# EAGLE design LPC_4TE_3.42taster Jalo (EAGLE 5.03)
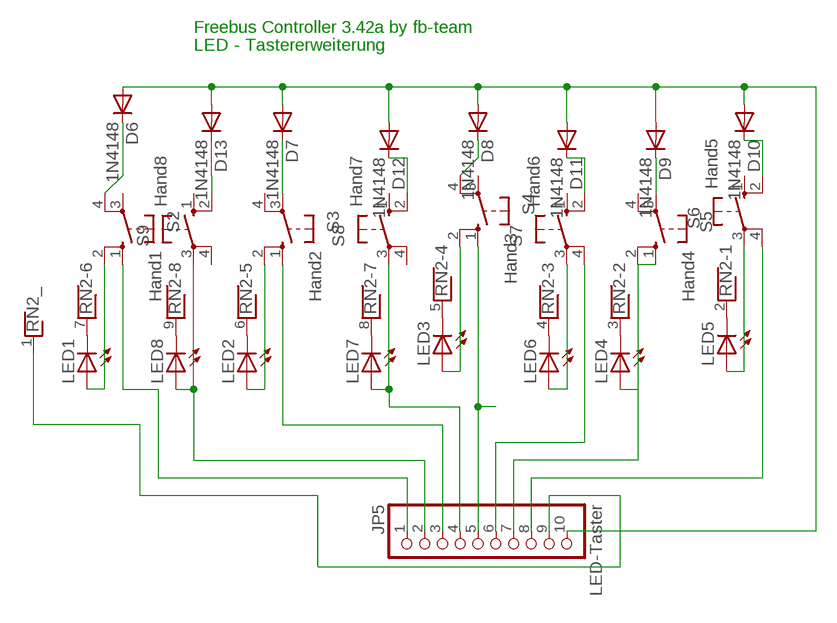
[diagram p0: schematic, sheet 1]

## Parts
D6  1N4148  [DO35-10]
D7  1N4148  [DO35-10]
D8  1N4148  [DO35-10]
D9  1N4148  [DO35-10]
D10  1N4148  [DO35-10]
D11  1N4148  [DO35-10]
D12  1N4148  [DO35-10]
D13  1N4148  [DO35-10]
JP5  LED-Taster  PINHD-1X10  [1X10]
LED1  LED3MM  [LED3MM]
LED2  LED3MM  [LED3MM]
LED3  LED3MM  [LED3MM]
LED4  LED3MM  [LED3MM]
LED5  LED3MM  [LED3MM]
LED6  LED3MM  [LED3MM]
LED7  LED3MM  [LED3MM]
LED8  LED3MM  [LED3MM]
RN2  RNX8  [RN-9]
S2  Hand1  10-XX  [B3F-10XX]
S3  Hand2  10-XX  [B3F-10XX]
S4  Hand3  10-XX  [B3F-10XX]
S5  Hand4  10-XX  [B3F-10XX]
S6  Hand5  10-XX  [B3F-10XX]
S7  Hand6  10-XX  [B3F-10XX]
S8  Hand7  10-XX  [B3F-10XX]
S9  Hand8  10-XX  [B3F-10XX]

## Nets
N$1: D6.C S2.4(P1)
N$2: LED5.A S6.3(P)
N$3: JP5.7 S5.1(S)
N$4: D10.C S6.2(S1)
N$5: D13.C S9.2(S1)
N$6: D8.C S4.4(P1)
N$7: D9.C S5.3(P)
N$8: LED1.A S2.2(S1)
N$9: D11.C S7.2(S1)
N$10: D12.C S8.2(S1)
N$11: D7.C S3.3(P)
N$12: JP5.5 S4.1(S)
N$13: LED7.K(C) RN2.8
N$14: LED1.K(C) RN2.7
N$15: LED6.K(C) RN2.4
N$16: LED5.K(C) RN2.2
N$17: LED4.K(C) RN2.3
N$18: LED3.K(C) RN2.5
N$19: LED2.K(C) RN2.6
N$20: LED8.K(C) RN2.9
N$21: JP5.6 S7.4(P1)
N$22: LED3.A S4.2(S1)
N$23: LED2.A S3.2(S1)
N$24: JP5.8 S6.4(P1)
N$25: JP5.9 RN2.1
N$26: LED6.A S7.3(P)
N$29: JP5.4 LED7.A S8.3(P)
N$30: JP5.2 LED8.A S9.3(P)
N$31: LED4.A S5.2(S1)
N$33: JP5.3 S3.1(S)
N$36: D6.A D7.A D8.A D9.A D10.A D11.A D12.A D13.A JP5.10
N$45: JP5.1 S2.1(S)
Unconnected: S2.3(P) S3.4(P1) S4.3(P) S5.4(P1) S6.1(S) S7.1(S) S8.1(S) S8.4(P1) S9.1(S) S9.4(P1)

## Notes on the sheet
- Freebus Controller 3.42a by fb-team
- LED - Tastererweiterung

## Library data of the parts
D6-D13 = diode:1N4148: DIODE high speed (Philips)
JP5 = pinhead:PINHD-1X10: PIN HEADER
LED1-LED8 = led:LED: LED OSRAM: - CHIPLED LG R971, LG N971, LY N971, LG Q971, LY Q971, LO R971, LY R971 LH N974, LH R974 LS Q976, LO Q976, LY Q976 LO Q996 - Hyper CHIPLED LW Q18S LB Q993, LB Q99A, LB R99A - SideLED LS A670, LO A670, LY A670, LG A670, LP A670 LB A673, LV A673, LT A673, LW A673 LH A674 LY A675 LS A676, LA A676, LO A676, LY A676, LW A676 LS A679, LY A679, LG A679 - Hyper Micro SIDELED® LS Y876, LA Y876, LO Y876, LY Y876 LT Y87S - SmartLED LW L88C, LW L88S LB L89C, LB L89S, LG L890 LS L89K, LO L89K, LY L89K LS L896, LA L896, LO L896, LY L896 - TOPLED LS T670, LO T670, LY T670, LG T670, LP T670 LSG T670, LSP T670, LSY T670, LOP T670, LYG T670 LG T671, LOG T671, LSG T671 LB T673, LV T673, LT T673, LW T673 LH T674 LS T676, LA T676, LO T676, LY T676, LB T676, LH T676, LSB T676, LW T676 LB T67C, LV T67C, LT T67C, LS T67K, LO T67K, LY T67K, LW E67C LS E67B, LA E67B, LO E67B, LY E67B, LB E67C, LV E67C, LT E67C LW T67C LS T679, LY T679, LG T679 LS T770, LO T770, LY T770, LG T770, LP T770 LB T773, LV T773, LT T773, LW T773 LH T774 LS E675, LA E675, LY E675, LS T675 LS T776, LA T776, LO T776, LY T776, LB T776 LHGB T686 LT T68C, LB T68C - Hyper Mini TOPLED® LB M676 - Mini TOPLED Santana® LG M470 LS M47K, LO M47K, LY M47K Source: http://www.osram.convergy.de - LUMILED® LXK2-PW12-R00, LXK2-PW12-S00, LXK2-PW14-U00, LXK2-PW14-V00 LXK2-PM12-R00, LXK2-PM12-S00, LXK2-PM14-U00 LXK2-PE12-Q00, LXK2-PE12-R00, LXK2-PE12-S00, LXK2-PE14-T00, LXK2-PE14-U00 LXK2-PB12-K00, LXK2-PB12-L00, LXK2-PB12-M00, LXK2-PB14-N00, LXK2-PB14-P00, LXK2-PB14-Q00 LXK2-PR12-L00, LXK2-PR12-M00, LXK2-PR14-Q00, LXK2-PR14-R00 LXK2-PD12-Q00, LXK2-PD12-R00, LXK2-PD12-S00 LXK2-PH12-R00, LXK2-PH12-S00 LXK2-PL12-P00, LXK2-PL12-Q00, LXK2-PL12-R00 Source: www.luxeon.com
RN2 = resistor-net:RNX8: RESISTOR NETWORK
S2-S9 = switch-omron:10-XX: OMRON SWITCH

## Board
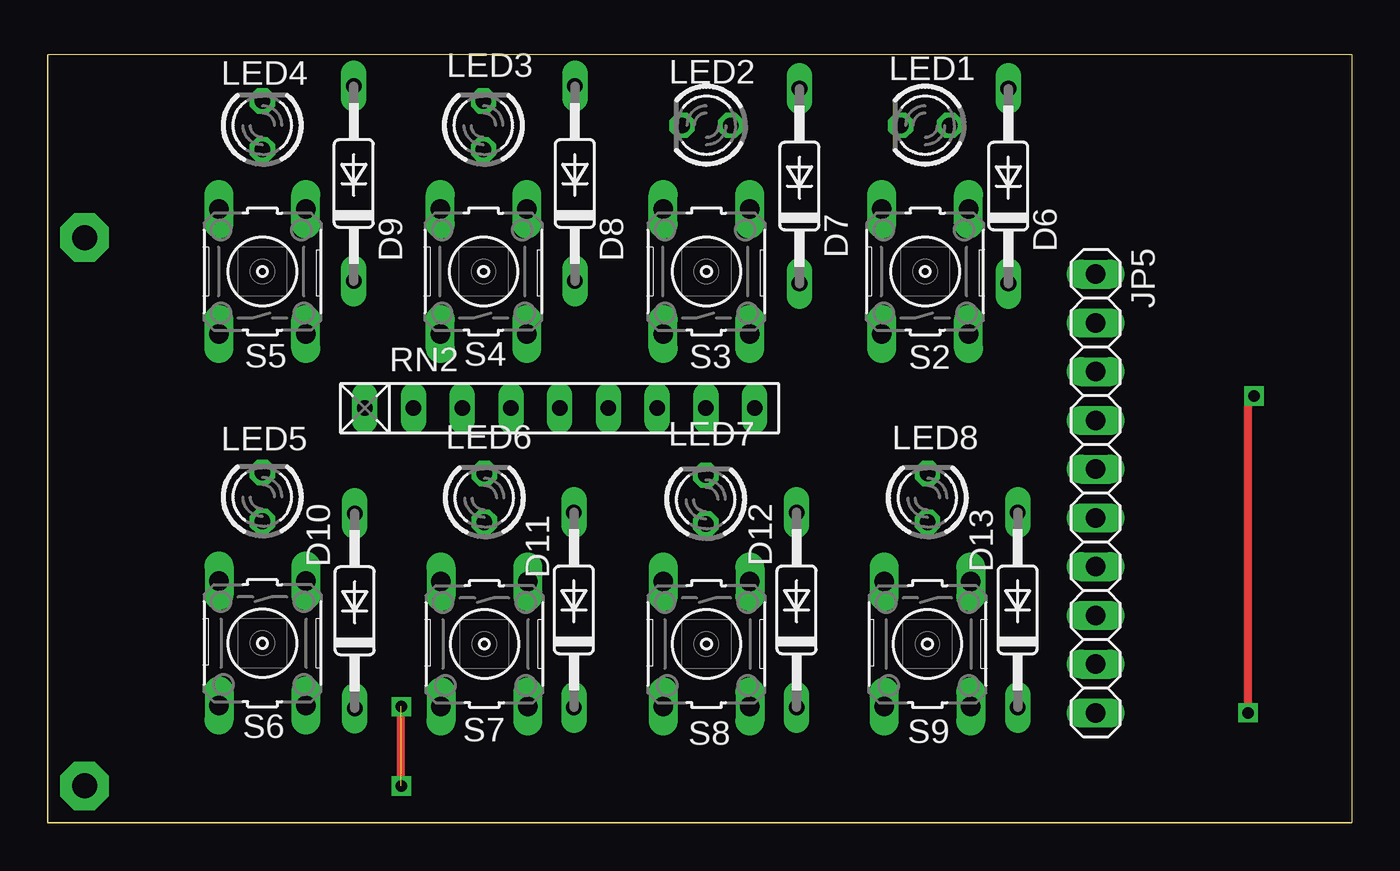
[diagram p1: board, top side]
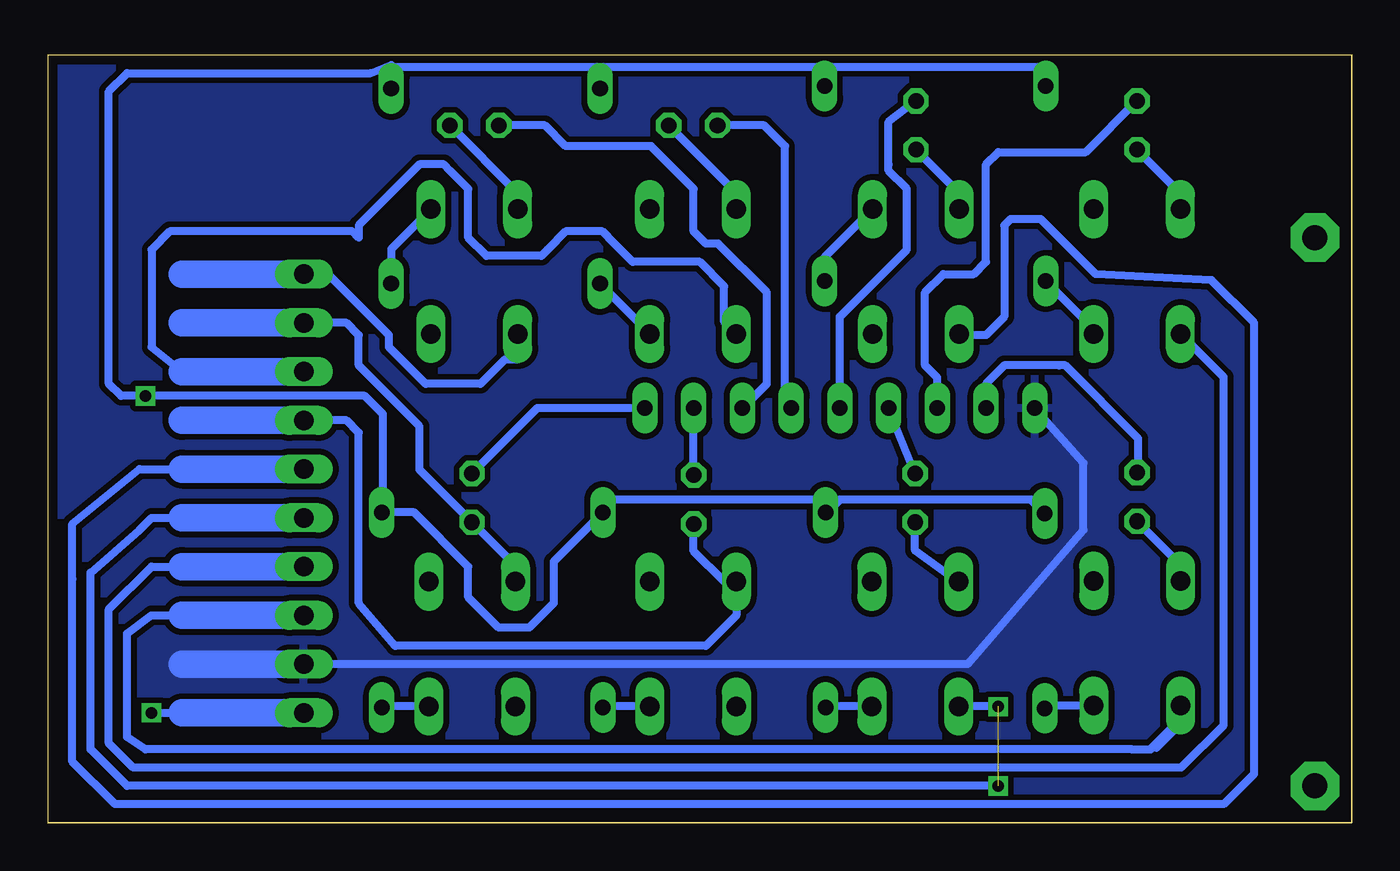
[diagram p2: board, bottom side, seen from below]

Size 67.94 x 40.01 mm. Coordinates in mm from the lower left corner, seen from the top.
Outline: 0,0 0,40.01
Outline: 67.94,0 67.94,40.01 0,40.01
Outline: 67.94,0 0,0
Outline: 0,40.01 0,0
Outline: 0,0 67.94,0
Copper layers (1*16): Top 0.035mm / dielectric 1.5mm / Bottom 0.035mm
Design rules "default *": minimum track width 10mil, minimum drill 24mil, track to track 12mil, track to pad 12mil, pad to pad 12mil, via to via 12mil, smd to smd 8mil, copper to edge 20mil, drill to drill 8mil, minimum pad ring 10mil, minimum via ring 8mil, stop-mask expansion 4mil, vias tented up to drill 0mil, thermal gap 10mil

### Footprints (pad centres in the part's own frame; a part is rotated, then mirrored left to right if it is on the bottom)
DO35-10 = drill 0.813 long: A 5.08,0; C -5.08,0
1X10 = drill 1.016 long: 1 -11.43,0; 2 -8.89,0; 3 -6.35,0; 4 -3.81,0; 5 -1.27,0; 6 1.27,0; 7 3.81,0; 8 6.35,0; 9 8.89,0; 10 11.43,0
LED3MM = drill 0.813 octagon: A -1.27,0; K 1.27,0
RN-9 = drill 0.813 long: 1 -10.16,0; 2 -7.62,0; 3 -5.08,0; 4 -2.54,0; 5 0,0; 6 2.54,0; 7 5.08,0; 8 7.62,0; 9 10.16,0
B3F-10XX = drill 1.016 long: 1 -3.251,2.261; 2 3.251,2.261; 3 -3.251,-2.261; 4 3.251,-2.261

### Placement (x,y rotation side)
D6  50.06,33.16 90 top
D7  39.17,33.16 90 top
D8  27.46,33.3 90 top
D9  15.94,33.3 90 top
D10  15.99,11.03 90 top
D11  27.41,11.08 90 top
D12  39.02,11.08 90 top
D13  50.54,11.08 90 top
JP5  54.61,17.14 270 top
LED1  45.72,36.33 180 top
LED2  34.32,36.33 180 top
LED3  22.7,36.33 90 top
LED4  11.18,36.33 90 top
LED5  11.18,16.96 90 top
LED6  22.75,16.92 90 top
LED7  34.29,16.83 90 top
LED8  45.84,16.92 90 top
RN2  26.67,21.59 0 top
S2  45.72,28.71 90 top
S3  34.32,28.71 90 top
S4  22.7,28.71 90 top
S5  11.18,28.71 90 top
S6  11.18,9.35 270 top
S7  22.75,9.3 270 top
S8  34.32,9.3 270 top
S9  45.84,9.3 270 top

### Tracks (layer width: path | path; a pad name or v marks a point on that pad's centre or on a via)
N$1
  Bottom 0.406: S2.4 50.06,29.88 D6.C
N$2
  Bottom 0.406: S6.3 8.92,13.43 LED5.A
N$3
  Bottom 0.406: JP5.7 60.96,13.34 62.55,13.34 64.77,11.11 64.77,4.13 63.5,2.86 8.89,2.86 6.67,5.08 6.67,23.2 S5.1
  Bottom 1.422: 60.96,13.34 54.29,13.34
N$4
  Bottom 0.406: S6.2 15.85,6.09 D10.C
N$5
  Bottom 0.406: S9.2 50.49,6.05 D13.C
N$6
  Bottom 0.406: S4.4 27.46,29.46 D8.C
N$7
  Bottom 0.406: S5.3 13.44,25.71 D9.C
N$8
  Bottom 0.406: S2.2 43.46,32.8 LED1.A
N$9
  Bottom 0.406: S7.2 27.37,6.05 D11.C
N$10
  Bottom 0.406: S8.2 38.97,6.05 D12.C
N$11
  Bottom 0.406: S3.3 36.58,25.49 D7.C
N$12
  Bottom 0.406: JP5.5 60.96,18.41 63.18,18.41 66.67,15.56 66.67,12.7 66.67,3.17 64.45,0.95 42.23,0.95 6.67,0.95 5.08,2.54 5.08,26.04 7.3,28.26 13.34,28.57 16.19,31.43 17.78,31.43 18.1,31.11 18.1,26.35 19.05,25.4 20.39,25.4 S4.1
  Bottom 1.422: 60.96,18.41 JP5.5
N$13
  Bottom 0.406: LED7.K RN2.8
N$14
  Bottom 0.406: LED1.K 42.04,36.33 40.96,35.24 36.51,35.24 34.29,33.02 34.29,30.8 33.66,30.16 33.02,30.16 30.48,27.62 30.48,22.86 RN2.7
N$15
  Bottom 0.406: LED6.K RN2.4
N$16
  Bottom 0.406: 11.43,18.23 LED5.K 11.11,18.3 11.11,20 14.92,23.81 15.24,23.81 18.1,23.81 19.05,22.86 RN2.2
N$17
  Bottom 0.406: RN2.3 21.59,23.18 22.23,23.81 22.23,27.62 21.27,28.57 19.68,28.57 19.05,29.21 19.05,34.29 18.41,34.92 13.85,34.92 LED4.K
N$18
  Bottom 0.406: LED3.K 24.13,36.51 24.13,34.29 24.13,33.97 23.18,33.02 23.18,29.84 26.67,26.35 RN2.5
N$19
  Bottom 0.406: LED2.K 30.61,36.33 29.53,35.24 29.53,21.91 29.53,21.59 RN2.6
N$20
  Bottom 0.406: RN2.9 42.44,21.59 LED8.K
N$21  (1 unrouted)
  Bottom 0.406: JP5.6 60.96,15.88 62.55,15.88 63.18,15.24 65.72,13.02 65.72,3.81 63.82,1.91 18.41,1.91 | S7.4 18.41,6.05 18.41,6.03
  Bottom 1.422: 60.96,15.88 JP5.6
N$22
  Bottom 0.406: S4.2 20.44,32.8 LED3.A
N$23
  Bottom 0.406: S3.2 32.06,32.8 LED2.A
N$24
  Bottom 0.254: 11.43,3.81 10.16,3.81 8.89,5.08 S6.4
  Bottom 0.406: JP5.8 55.24,10.79 60.96,10.79 62.55,10.79 63.82,9.84 63.82,4.45 62.87,3.81 11.43,3.81 10.48,3.81 8.92,5.37
  Bottom 1.422: 60.96,10.79 JP5.8
N$25
  Bottom 0.406: 54.93,8.26 51.75,8.26 20,8.26 13.97,15.24 13.97,18.73 RN2.1
  Bottom 1.422: JP5.9 54.93,8.26 60.96,8.26
  pour Bottom: 0,0 0,40.01 68,40.01 68,0
N$26
  Bottom 0.406: S7.3 22.75,14.17 LED6.A
N$27  (via drill 1.3 pad 2.54)
  other vias: 1.91,30.48
N$28  (via drill 1.3 pad 2.54)
  other vias: 1.91,1.91
N$29
  Bottom 0.406: LED7.A 34.29,14.14 32.69,12.55 S8.3 32.07,10.79 32.7,10.16 33.66,9.21 49.85,9.21 51.75,11.43 51.75,20.32 52.39,20.95 JP5.4
  Bottom 1.422: JP5.4 60.96,20.95
N$30
  Bottom 0.406: JP5.2 54.29,26.04 52.39,26.04 51.75,25.4 51.75,23.81 48.58,20.64 48.58,18.38 LED8.A 43.58,13.39 S9.3
  Bottom 1.422: 54.29,26.04 60.96,26.04
N$31
  Bottom 0.406: LED4.A 8.92,32.8 S5.2
N$32  (via drill 0.6)
  Top 0.406: v18.41,1.91 v18.41,6.03
N$33
  Bottom 0.406: 60.96,23.5 62.55,24.77 62.55,29.84 61.59,30.8 52.07,30.8 51.75,30.48 51.75,31.11 48.58,34.29 47.31,34.29 46.99,33.97 46.04,33.02 46.04,30.48 45.09,29.53 42.23,29.53 41.91,29.84 40.96,30.8 39.05,30.8 38.42,30.16 37.47,29.21 33.97,29.21 32.7,27.94 32.7,26.1 S3.1
  Bottom 1.422: 60.96,23.5 JP5.3
N$36  (via drill 0.6)
  Top 0.406: v62.55,5.71 62.55,21.91 v62.87,22.23
  Bottom 0.254: 39.37,39.37 D7.A | 27.94,39.37 D8.A
  Bottom 0.406: JP5.10 60.96,5.71 v62.55,5.71 | 39.05,39.37 39.37,39.37 50.16,39.37 50.16,38.35 D6.A 50.06,39.48 51.12,39.05 63.82,39.05 64.77,38.1 64.77,22.86 64.14,22.23 v62.87,22.23 51.44,22.23 50.48,21.27 50.48,16.22 D13.A 48.86,16.16 46.04,13.34 46.04,11.75 44.45,10.16 43.5,10.16 42.86,10.16 41.59,11.43 41.59,13.59 D12.A 39.02,16.8 39.05,16.83 27.3,16.83 27.3,16.27 D11.A 27.34,16.16 26.67,16.83 26.04,16.83 16.71,16.83 D10.A | 39.05,39.37 39.17,39.25 | 39.05,39.37 39.05,38.36 | 39.05,39.37 27.94,39.37 27.62,39.37 27.46,39.21 | D8.A 27.46,39.37 15.88,39.37 15.88,38.38 D9.A
  Bottom 1.422: 60.96,5.71 JP5.10
N$45
  Bottom 0.406: S2.1 43.5,24.13 44.13,24.13 45.4,22.86 48.26,22.86 50.16,24.77 50.16,25.4 53.34,28.57 JP5.1
  Bottom 1.422: JP5.1 60.96,28.57